# Altium schematic sheet Rs232_Interface.SchDoc
size A4; DrawnBy: Hanif; DocumentNumber: 7; SheetNumber: 7; SheetTotal: 8
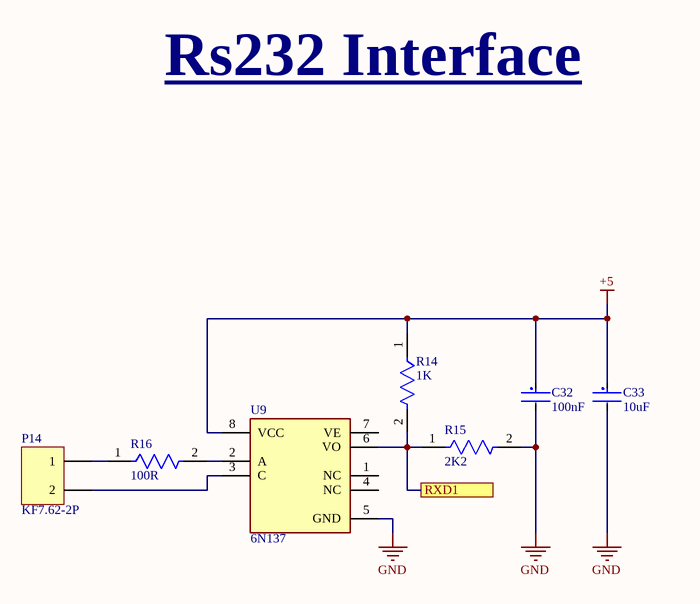
[diagram p0: Rs232_Interface.SchDoc]

## Parts
C32  100nF  [Samsung_CL31_IPC_A_1206]
C33  10uF  [Samsung_CL31_IPC_A_1206]
P14  KF7.62-2P  [KF7.62-2P Barrier Terminal Block]
R14  1K  [YAGEO_RC1206-0_65_IPC_A]
R15  2K2  [YAGEO_RC1206-0_65_IPC_A]
R16  100R  [YAGEO_RC1206-0_65_IPC_A]
U9  Part Number: 6N137  [DIP_08]  (hidden comment: IC_Vishay_6N137_eec)

## Ports
RXD1

## Nets
+5: C32.1 C33.1 R14.1 U9.8(VCC)
GND: C32.2 C33.2 R15.2 U9.5(GND)
RXD1: R14.2 R15.1 U9.6(VO) ; port RXD1
NetP14_1: P14.1 R16.1
NetP14_2: P14.2 U9.3(C)
NetR16_2: R16.2 U9.2(A)

Not connected (* = marked no-connect by the designer): U9 1(NC) 4(NC) 7(VE)

## Notes on the sheet
- Rs232 Interface
- Project Name:
- Size:
- Date:
- A4
- Doc Num:
- Time:
- Version:
- Sheet
- of
- File:
- Drawn by:

## Library data of the parts
C32 = CL31B104KBCNFNC: CAP CER 0.1UF 50V X7R 1206, ±10% 50V Ceramic Capacitor X7R 1206 (3216 Metric); Supplier 1: Digi-Key; Supplier Part Number 1: 1276-2744-1-ND
C33 = CL31A106KQHNNWE: CAP CER 10UF 6.3V X5R 1206, ±10% 6.3V Ceramic Capacitor X5R 1206 (3216 Metric); Supplier 1: Digi-Key; Supplier Part Number 1: 1276-3043-1-ND
P14 = KF7.62-2P Barrier Terminal Block: KF7.62-2P Barrier Terminal Block, 7.62mm spacing barrier terminals with side expandable slot. The terminal accepts wire gauge of 22~12AWG. Connectors are available black PA66 material.
R14 = RC1206JR-071KL: 1 ±5% 0.25W, 1/4W Chip Resistor 1206 (3216 Metric) Moisture Resistant Thick Film; Supplier 1: Digi-Key; Supplier Part Number 1: 311-1.0KERCT-ND
R15 = RC1206FR-072K2L: YAGEO - RC1206FR-072K2L - Surface Mount Chip Resistor, Thick Film, RC Series, 2.2 kohm, 250 mW, 1%, 200 V RoHS Compliant: Yes; Resistance: 2.2kR; Power Rating: 250mW; Temperature Coefficient: 100ppm/°C; Voltage Rating: 200V; Supplier 1: Digi-Key; Manufacturer: Yageo; Manufacturer Part Number: RC1206FR-072K2L; RoHS: Yes; Category: Chip SMD Resistors; Stock 1: 160197; Pricing 1: 1=0.10000, 10=0.07400, 100=0.03010, 1000=0.01353, 2500=0.01174 (USD); Case/Package: 1206; Case Code (Metric): 3216; Case Code (Imperial): 1206; Weight: 0.000571oz; Size Code: 1206; Min Operating Temperature: -55°C; Max Operating Temperature: 155°C; Tolerance: 1%; Packaging: Tape and Reel; Package Quantity: 1; Resistor Type: Thick Film; Number of Terminations: 2; Termination: SMD/SMT; Max Power Dissipation: 250mW; Features: Moisture Resistant; Series: RC; Resistance Tolerance: 1%; Construction: Rectangular; Length: 3.2mm; Width: 1.6mm; Height: 0.55mm; Depth: 1.6mm; REACH SVHC: Unknown; Lead Free: Lead Free; Military Standard: Not; RoHS Compliant: Yes; ComponentLink1URL: https://datasheet.ciiva.com/2461/pyu-rc1206-51-rohs-l-4-2461488.pdf?src-supplier=Digi-Key; ComponentLink1Description: https://datasheet.ciiva.com/2461/pyu-rc1206-51-rohs-l-4-2461488.pdf?src-supplier=Digi-Key; ComponentLink2URL: https://datasheet.ciiva.com/2461/pyu-rc1206-51-rohs-l-4-2461489.pdf?src-supplier=Digi-Key; ComponentLink2Description: https://datasheet.ciiva.com/2461/pyu-rc1206-51-rohs-l-4-2461489.pdf?src-supplier=Digi-Key; ComponentLink3URL: https://datasheet.ciiva.com/2461/pyu-rc1206-51-rohs-l-4-2461490.pdf?src-supplier=Digi-Key; ComponentLink3Description: https://datasheet.ciiva.com/2461/pyu-rc1206-51-rohs-l-4-2461490.pdf?src-supplier=Digi-Key; ComponentLink4URL: https://datasheet.ciiva.com/16978/pyu-rc1206-51-rohs-l-4-16978023.pdf?src-supplier=Future+Electronics; ComponentLink4Description: https://datasheet.ciiva.com/16978/pyu-rc1206-51-rohs-l-4-16978023.pdf?src-supplier=Future+Electronics; Supplier Part Number 1: 311-2.20KFRCT-ND
R16 = RC1206JR-07100RL: 100 ±5% 0.25W, 1/4W Chip Resistor 1206 (3216 Metric) Moisture Resistant Thick Film; Supplier 1: Newark; Supplier Part Number 1: 12AC2283
U9 = IC_Vishay_6N137_eec: IC OPTOISO 5.3KV 1CH OPN DRAIN 8DIP; Manufacturer: Vishay; helpURL: https://upverter.com/upn/revision/90ff24e5d1aaa85f/; ComponentLink2Description: Datasheet; Temperature: -40°C to +100°C; Package: DIP8; Supplier 2: Mouser; Price: 1.00620280459; Supplier 1: Digi-Key; ComponentLink1URL: https://upverter.com/upn/revision/90ff24e5d1aaa85f/; Supplier Part Number 2: 782-6N137; Supplier Part Number 1: 751-1262-5-ND; ComponentLink1Description: Upverter; ComponentLink2URL: http://www.vishay.com/docs/84732/6n137.pdf; RoHS: TRUE; Mouser Part Number: 782-6N137; Ipc Land Pattern Name: DIP762W50P254L1016H425Q8; Temperature Range High: +100°C; Digikey Description: IC OPTOISO 5.3KV 1CH OPN DRAIN 8DIP; Digikey Part Number: 751-1262-5-ND; Lead Free: yes; Temperature Range Low: -40°C